# EAGLE design ULN2003A-Relay-Driver (EAGLE 9.6.2)
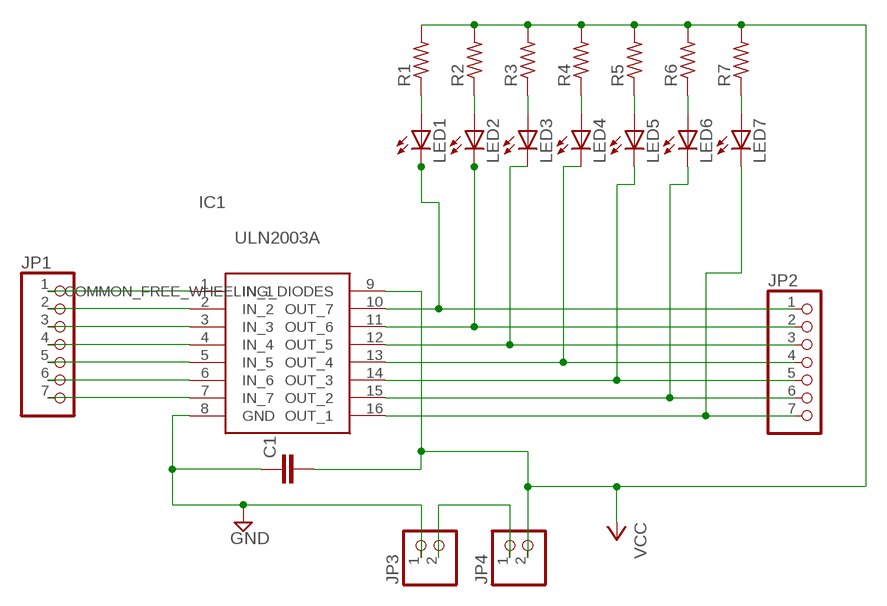
[diagram p0: schematic, sheet 1]

## Parts
C1  C5/5  [C5B5]
IC1  ULN2003A  [DIP794W56P254L1888H533Q16N]
JP1  PINHD-1X7  [1X07]
JP2  PINHD-1X7  [1X07]
JP3  PINHD-1X2  [1X02]
JP4  PINHD-1X2  [1X02]
LED1  LED3MM  [LED3MM]
LED2  LED3MM  [LED3MM]
LED3  LED3MM  [LED3MM]
LED4  LED3MM  [LED3MM]
LED5  LED3MM  [LED3MM]
LED6  LED3MM  [LED3MM]
LED7  LED3MM  [LED3MM]
R1  R-US_0204/7  [0204/7]
R2  R-US_0204/7  [0204/7]
R3  R-US_0204/7  [0204/7]
R4  R-US_0204/7  [0204/7]
R5  R-US_0204/7  [0204/7]
R6  R-US_0204/7  [0204/7]
R7  R-US_0204/7  [0204/7]

## Nets
GND: C1.1 IC1.8(GND) JP3.1
N$1: IC1.1(IN_1) JP1.1
N$2: IC1.2(IN_2) JP1.2
N$3: IC1.3(IN_3) JP1.3
N$4: IC1.4(IN_4) JP1.4
N$5: IC1.5(IN_5) JP1.5
N$6: IC1.6(IN_6) JP1.6
N$7: IC1.7(IN_7) JP1.7
N$10: IC1.16(OUT_1) JP2.7 LED7.K(C)
N$12: IC1.14(OUT_3) JP2.5 LED5.K(C)
N$13: IC1.13(OUT_4) JP2.4 LED4.K(C)
N$14: IC1.12(OUT_5) JP2.3 LED3.K(C)
N$15: IC1.11(OUT_6) JP2.2 LED2.K(C)
N$16: IC1.10(OUT_7) JP2.1 LED1.K(C)
N$17: JP3.2 JP4.1
N$19: LED1.A R1.1
N$20: LED2.A R2.1
N$21: LED3.A R3.1
N$22: LED4.A R4.1
N$23: LED5.A R5.1
N$24: LED6.A R6.1
N$25: LED7.A R7.1
N$29: IC1.15(OUT_2) JP2.6 LED6.K(C)
VCC: C1.2 IC1.9(COMMON_FREE_WHEELING_DIODES) JP4.2 R1.2 R2.2 R3.2 R4.2 R5.2 R6.2 R7.2

## Library data of the parts
C1 = capacitor-wima:C: CAPACITOR naming: grid - package width
IC1 = ULN2003A:ULN2003A: Darlington Array x7 NPN 50V 0.5A PDIP16 STMicroelectronics ULN2003A, 7-element NPN Darlington Transistor Array, 0.5 A 50 V HFE:1000, 16-Pin PDIP Source: Datasheet <http://www.st.com/web/en/resource/technical/document/datasheet/CD00001244.pdf>; ARROW_PART_NUMBER: ULN2003A; ARROW_PRICE-STOCK: https://www.arrow.com/en/products/uln2003a/stmicroelectronics?region=nac; DESCRIPTION: Darlington Array x7 NPN 50V 0.5A PDIP16 STMicroelectronics ULN2003A, 7-element NPN Darlington Transistor Array, 0.5 A 50 V HFE:1000, 16-Pin PDIP; HEIGHT: 5.33mm; MANUFACTURER_NAME: STMicroelectronics; MANUFACTURER_PART_NUMBER: ULN2003A; MOUSER_PART_NUMBER: 511-ULN2003A; MOUSER_PRICE-STOCK: https://www.mouser.co.uk/ProductDetail/STMicroelectronics/ULN2003A?qs=FOlmdCx%252BAA1P2avu3tWCRw%3D%3D
JP1 JP2 = pinhead:PINHD-1X7: PIN HEADER
JP3 JP4 = pinhead:PINHD-1X2: PIN HEADER
LED1-LED7 = adafruit:LED: LED OSRAM: - CHIPLED LG R971, LG N971, LY N971, LG Q971, LY Q971, LO R971, LY R971 LH N974, LH R974 LS Q976, LO Q976, LY Q976 LO Q996 - Hyper CHIPLED LW Q18S LB Q993, LB Q99A, LB R99A - SideLED LS A670, LO A670, LY A670, LG A670, LP A670 LB A673, LV A673, LT A673, LW A673 LH A674 LY A675 LS A676, LA A676, LO A676, LY A676, LW A676 LS A679, LY A679, LG A679 - Hyper Micro SIDELED® LS Y876, LA Y876, LO Y876, LY Y876 LT Y87S - SmartLED LW L88C, LW L88S LB L89C, LB L89S, LG L890 LS L89K, LO L89K, LY L89K LS L896, LA L896, LO L896, LY L896 - TOPLED LS T670, LO T670, LY T670, LG T670, LP T670 LSG T670, LSP T670, LSY T670, LOP T670, LYG T670 LG T671, LOG T671, LSG T671 LB T673, LV T673, LT T673, LW T673 LH T674 LS T676, LA T676, LO T676, LY T676, LB T676, LH T676, LSB T676, LW T676 LB T67C, LV T67C, LT T67C, LS T67K, LO T67K, LY T67K, LW E67C LS E67B, LA E67B, LO E67B, LY E67B, LB E67C, LV E67C, LT E67C LW T67C LS T679, LY T679, LG T679 LS T770, LO T770, LY T770, LG T770, LP T770 LB T773, LV T773, LT T773, LW T773 LH T774 LS E675, LA E675, LY E675, LS T675 LS T776, LA T776, LO T776, LY T776, LB T776 LHGB T686 LT T68C, LB T68C - Hyper Mini TOPLED® LB M676 - Mini TOPLED Santana® LG M470 LS M47K, LO M47K, LY M47K Source: http://www.osram.convergy.de/
R1-R7 = rcl:R-US_: RESISTOR, American symbol; SPICEPREFIX: R

## Board
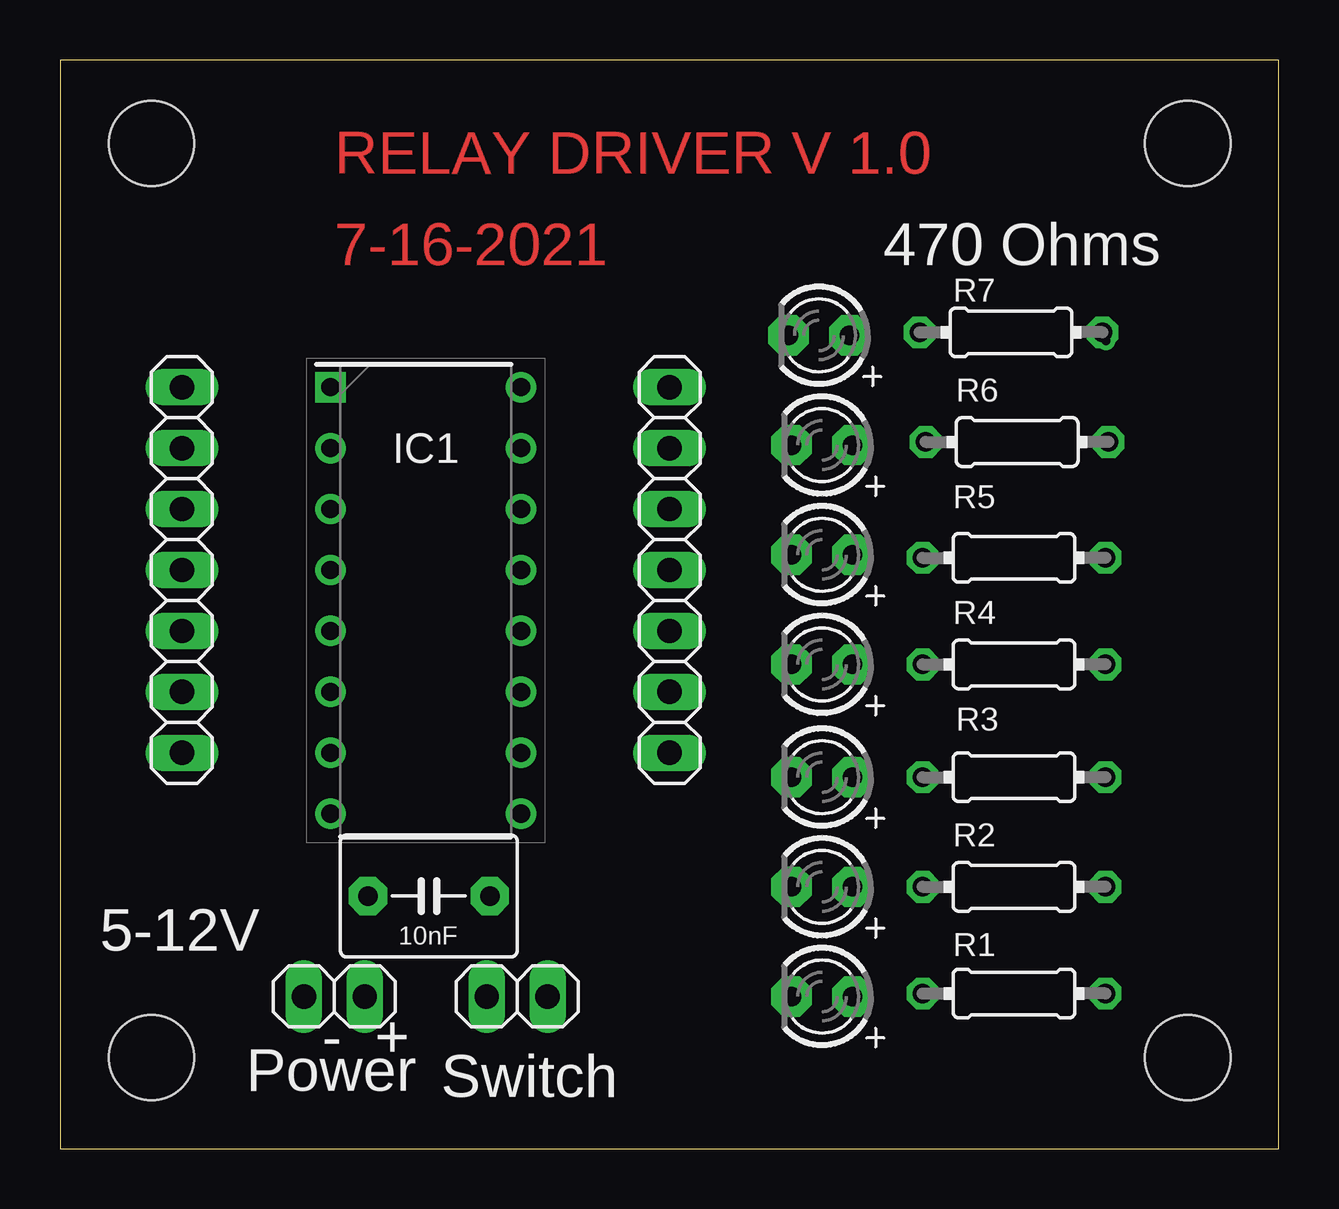
[diagram p1: board, top side]
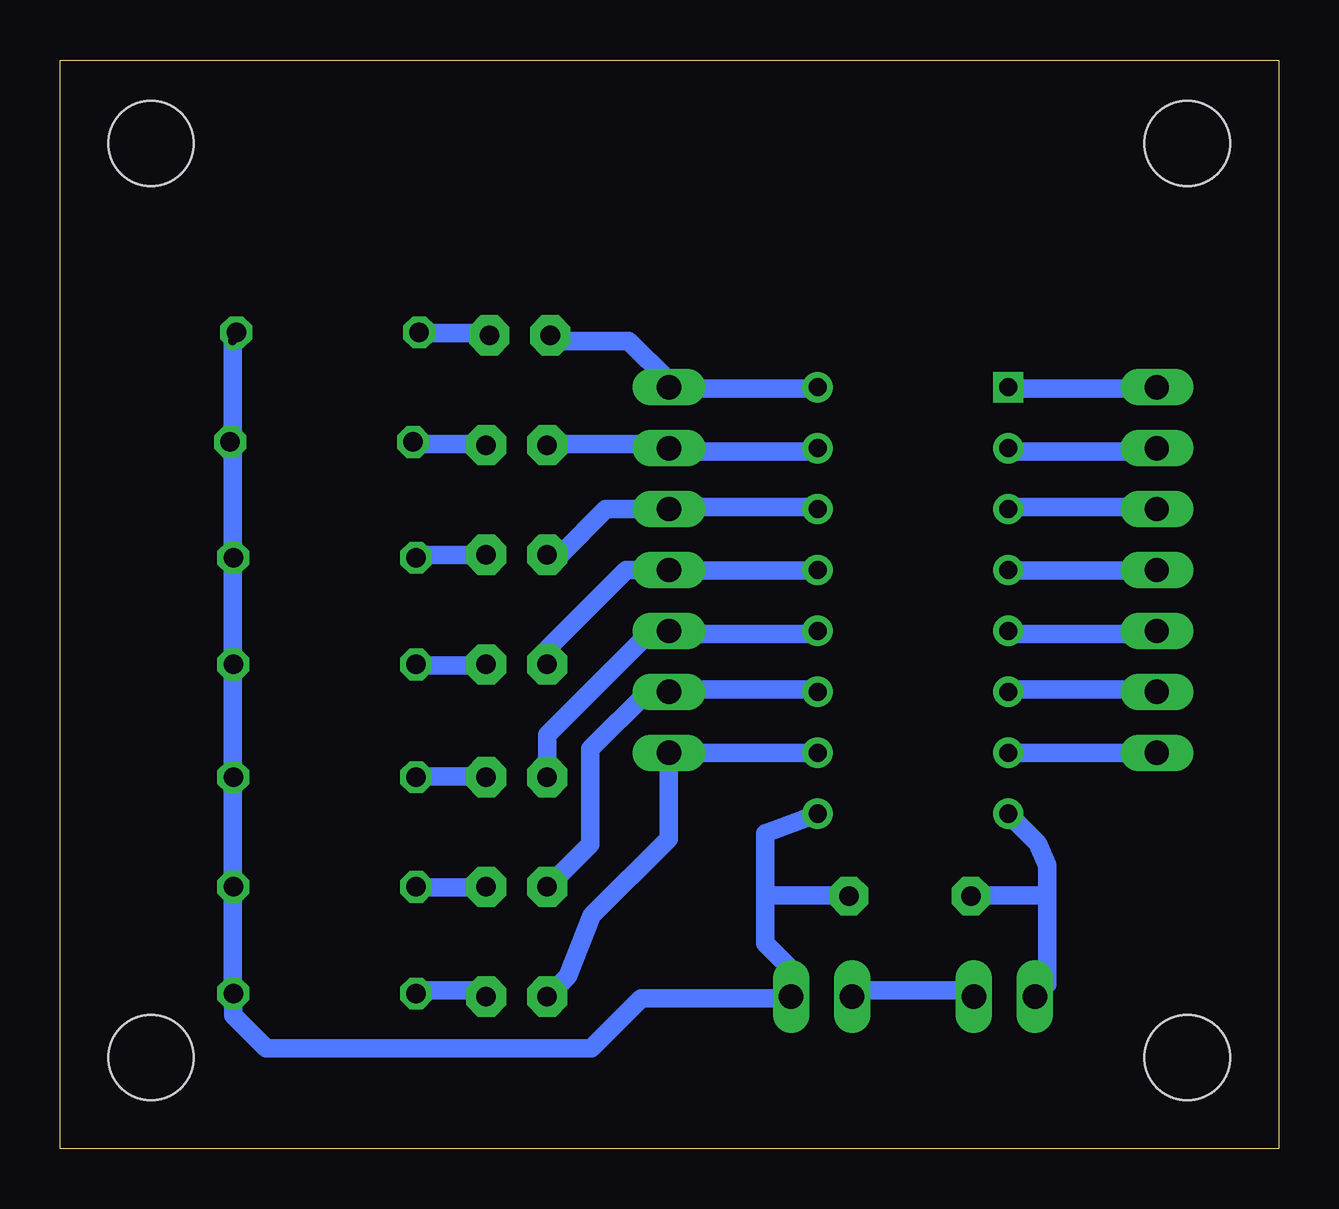
[diagram p2: board, bottom side, seen from below]

Size 50.78 x 45.39 mm. Coordinates in mm from the lower left corner, seen from the top.
Outline: 0,0 50.78,0 50.78,45.39 0,45.39 0,0
Copper layers (1*16): Top 0.035mm / dielectric 1.5mm / Bottom 0.035mm
Design rules "default *": minimum track width 20mil, minimum drill 0.35mm, track to track 6mil, track to pad 6mil, pad to pad 6mil, via to via 6mil, smd to smd 6mil, copper to edge 40mil, drill to drill 6mil, minimum pad ring 10mil, minimum via ring 8mil, stop-mask expansion 4mil, vias tented up to drill 0mil, thermal gap 10mil
Holes 3.56 mm at 3.81,41.91 46.99,41.91 46.99,3.81 3.81,3.81

### Footprints (pad centres in the part's own frame; a part is rotated, then mirrored left to right if it is on the bottom)
C5B5 = drill 0.813 pad 1.6 octagon: 1 -2.54,0; 2 2.54,0
DIP794W56P254L1888H533Q16N = drill 0.76 pad 1.16 square: 1 -3.97,8.89 | drill 0.76 pad 1.16: 2 -3.97,6.35; 3 -3.97,3.81; 4 -3.97,1.27; 5 -3.97,-1.27; 6 -3.97,-3.81; 7 -3.97,-6.35; 8 -3.97,-8.89; 9 3.97,-8.89; 10 3.97,-6.35; 11 3.97,-3.81; 12 3.97,-1.27; 13 3.97,1.27; 14 3.97,3.81; 15 3.97,6.35; 16 3.97,8.89
1X07 = drill 1.016 long: 1 -7.62,0; 2 -5.08,0; 3 -2.54,0; 4 0,0; 5 2.54,0; 6 5.08,0; 7 7.62,0
1X02 = drill 1.016 long: 1 -1.27,0; 2 1.27,0
LED3MM = drill 0.813 pad 1.676 octagon: A -1.27,0; K 1.27,0
0204/7 = drill 0.813 octagon: 1 -3.81,0; 2 3.81,0

### Placement (x,y rotation side)
C1  15.37,10.54 0 top
IC1  15.24,22.86 0 top
JP1  5.08,24.13 270 top
JP2  25.4,24.13 90 top
JP3  11.43,6.35 0 top
JP4  19.05,6.35 0 top
LED1  31.75,6.35 180 top
LED2  31.75,10.92 180 top
LED3  31.75,15.49 180 top
LED4  31.75,20.19 180 top
LED5  31.75,24.77 180 top
LED6  31.75,29.34 180 top
LED7  31.62,33.91 180 top
R1  39.75,6.48 0 top
R2  39.75,10.92 0 top
R3  39.75,15.49 0 top
R4  39.75,20.19 0 top
R5  39.75,24.64 0 top
R6  39.88,29.46 0 top
R7  39.62,34.04 0 top

### Tracks (layer width: path | path; a pad name or v marks a point on that pad's centre or on a via)
GND
  Bottom 0.508: 12.55,10.57 C1.1
  Bottom 0.762: 9.65,10.57 9.65,11.82 10.04,12.74 IC1.8 | 9.65,10.57 9.65,6.86 JP3.1 | 9.65,10.57 10.57,10.57 12.55,10.57
N$1
  Bottom 0.508: 11.23,31.7 IC1.1 | 5.28,31.7 JP1.1
  Bottom 0.762: 5.28,31.7 11.23,31.7
N$2
  Bottom 0.508: 11.23,29.06 IC1.2 | 5.28,29.06 JP1.2
  Bottom 0.762: 5.28,29.06 11.23,29.06
N$3
  Bottom 0.508: 11.23,26.75 IC1.3 | 5.28,26.75 JP1.3
  Bottom 0.762: 5.28,26.75 11.23,26.75
N$4
  Bottom 0.508: 11.23,24.11 IC1.4 | 5.28,24.11 JP1.4
  Bottom 0.762: 5.28,24.11 11.23,24.11
N$5
  Bottom 0.508: 11.23,21.46 IC1.5 | 5.28,21.46 JP1.5
  Bottom 0.762: 5.28,21.46 11.23,21.46
N$6
  Bottom 0.508: 11.23,19.15 IC1.6 | 5.28,19.15 JP1.6
  Bottom 0.762: 5.28,19.15 11.23,19.15
N$7
  Bottom 0.762: JP1.7 IC1.7
N$10
  Bottom 0.508: 19.48,31.7 IC1.16 | 25.09,31.7 JP2.7 25.43,32.03
  Bottom 0.762: 25.09,31.7 19.48,31.7 | 25.43,32.03 27.08,33.68 30.05,33.68 LED7.K
N$12
  Bottom 0.508: 19.48,26.75 IC1.14 | 25.09,26.75 JP2.5
  Bottom 0.762: 25.09,26.75 19.48,26.75 | LED5.K 29.95,24.77 28.04,26.67 JP2.5
N$13
  Bottom 0.508: 19.48,24.11 IC1.13 | 25.09,24.11 JP2.4
  Bottom 0.762: 25.09,24.11 19.48,24.11 | JP2.4 27.18,24.13 30.48,20.83 LED4.K
N$14
  Bottom 0.508: 19.48,21.46 IC1.12 | 25.09,21.46 JP2.3
  Bottom 0.762: 25.09,21.46 19.48,21.46 | LED3.K 30.48,17.26 26.15,21.59 JP2.3
N$15
  Bottom 0.508: 19.48,19.15 IC1.11 | 25.09,19.15 JP2.2
  Bottom 0.762: 25.09,19.15 19.48,19.15 | LED2.K 30.45,10.92 28.68,12.7 28.68,16.66 26.29,19.05 JP2.2
N$16
  Bottom 0.508: 25.43,16.51 JP2.1
  Bottom 0.762: JP2.1 IC1.10 | 25.43,16.51 25.43,12.93 28.62,9.74 29.63,7.2 LED1.K
N$17
  Bottom 0.762: JP3.2 12.88,6.6 17.5,6.6 JP4.1
N$19
  Bottom 0.762: R1.1 35.66,6.6 33.02,6.6 LED1.A
N$20
  Bottom 0.762: R2.1 35.66,10.9 33.02,10.9 LED2.A
N$21
  Bottom 0.762: R3.1 35.66,15.52 33.02,15.52 LED3.A
N$22
  Bottom 0.762: R4.1 35.66,20.14 33.02,20.14 LED4.A
N$23
  Bottom 0.762: LED5.A 35.66,24.77 R5.1
N$24
  Bottom 0.762: R6.1 35.99,29.39 33.02,29.39 LED6.A
N$25  (via drill 0.35)
  Bottom 0.762: LED7.A 33.02,34.01 v35.66,34.01 35.99,34.01 R7.1
N$29
  Bottom 0.508: 19.48,29.06 IC1.15 | 25.09,29.06 JP2.6 25.43,29.39 | 30.38,29.39 LED6.K
  Bottom 0.762: 25.09,29.06 19.48,29.06 | 25.43,29.39 30.38,29.39
VCC  (via drill 0.35)
  Bottom 0.508: JP4.2 20.32,7.49 | 43.59,29.72 R6.2 43.59,29.39 | 43.59,6.6 R1.2 | 43.59,15.19 R3.2 | 43.59,11.23 R2.2 | 43.59,20.14 R4.2 | 43.59,34.01 v43.59,33.68 | 18.16,10.57 C1.2
  Bottom 0.762: 20.32,7.49 21.39,8.56 21.39,10.57 | 21.39,10.57 21.39,13.16 IC1.9 | 43.59,29.72 v43.59,33.68 | R4.2 43.59,20.47 43.59,24.43 R5.2 43.59,24.77 43.59,29.39 | 43.59,6.6 43.59,10.9 R2.2 | 43.59,11.23 43.59,15.19 | 43.59,20.14 43.59,15.52 R3.2 | R1.2 43.56,5.56 42.19,4.19 28.65,4.19 26.57,6.27 20.47,6.27 JP4.2 | 43.59,34.01 R7.2 | 21.39,10.57 20.8,10.57 18.16,10.57

### Text on the board
Top: RELAY DRIVER V 1.0 | 7-16-2021
tNames: 470 Ohms | 10nF | 5-12V | - + | Power | Switch